# EasyEDA schematic SCH_d_00_e_02.json
TITLE: Sheet_1; REV: 1.0; Date: 2025-01-09; Sheet: 1/1; Drawn By: artem.v.ulyanov; Company: Your Company
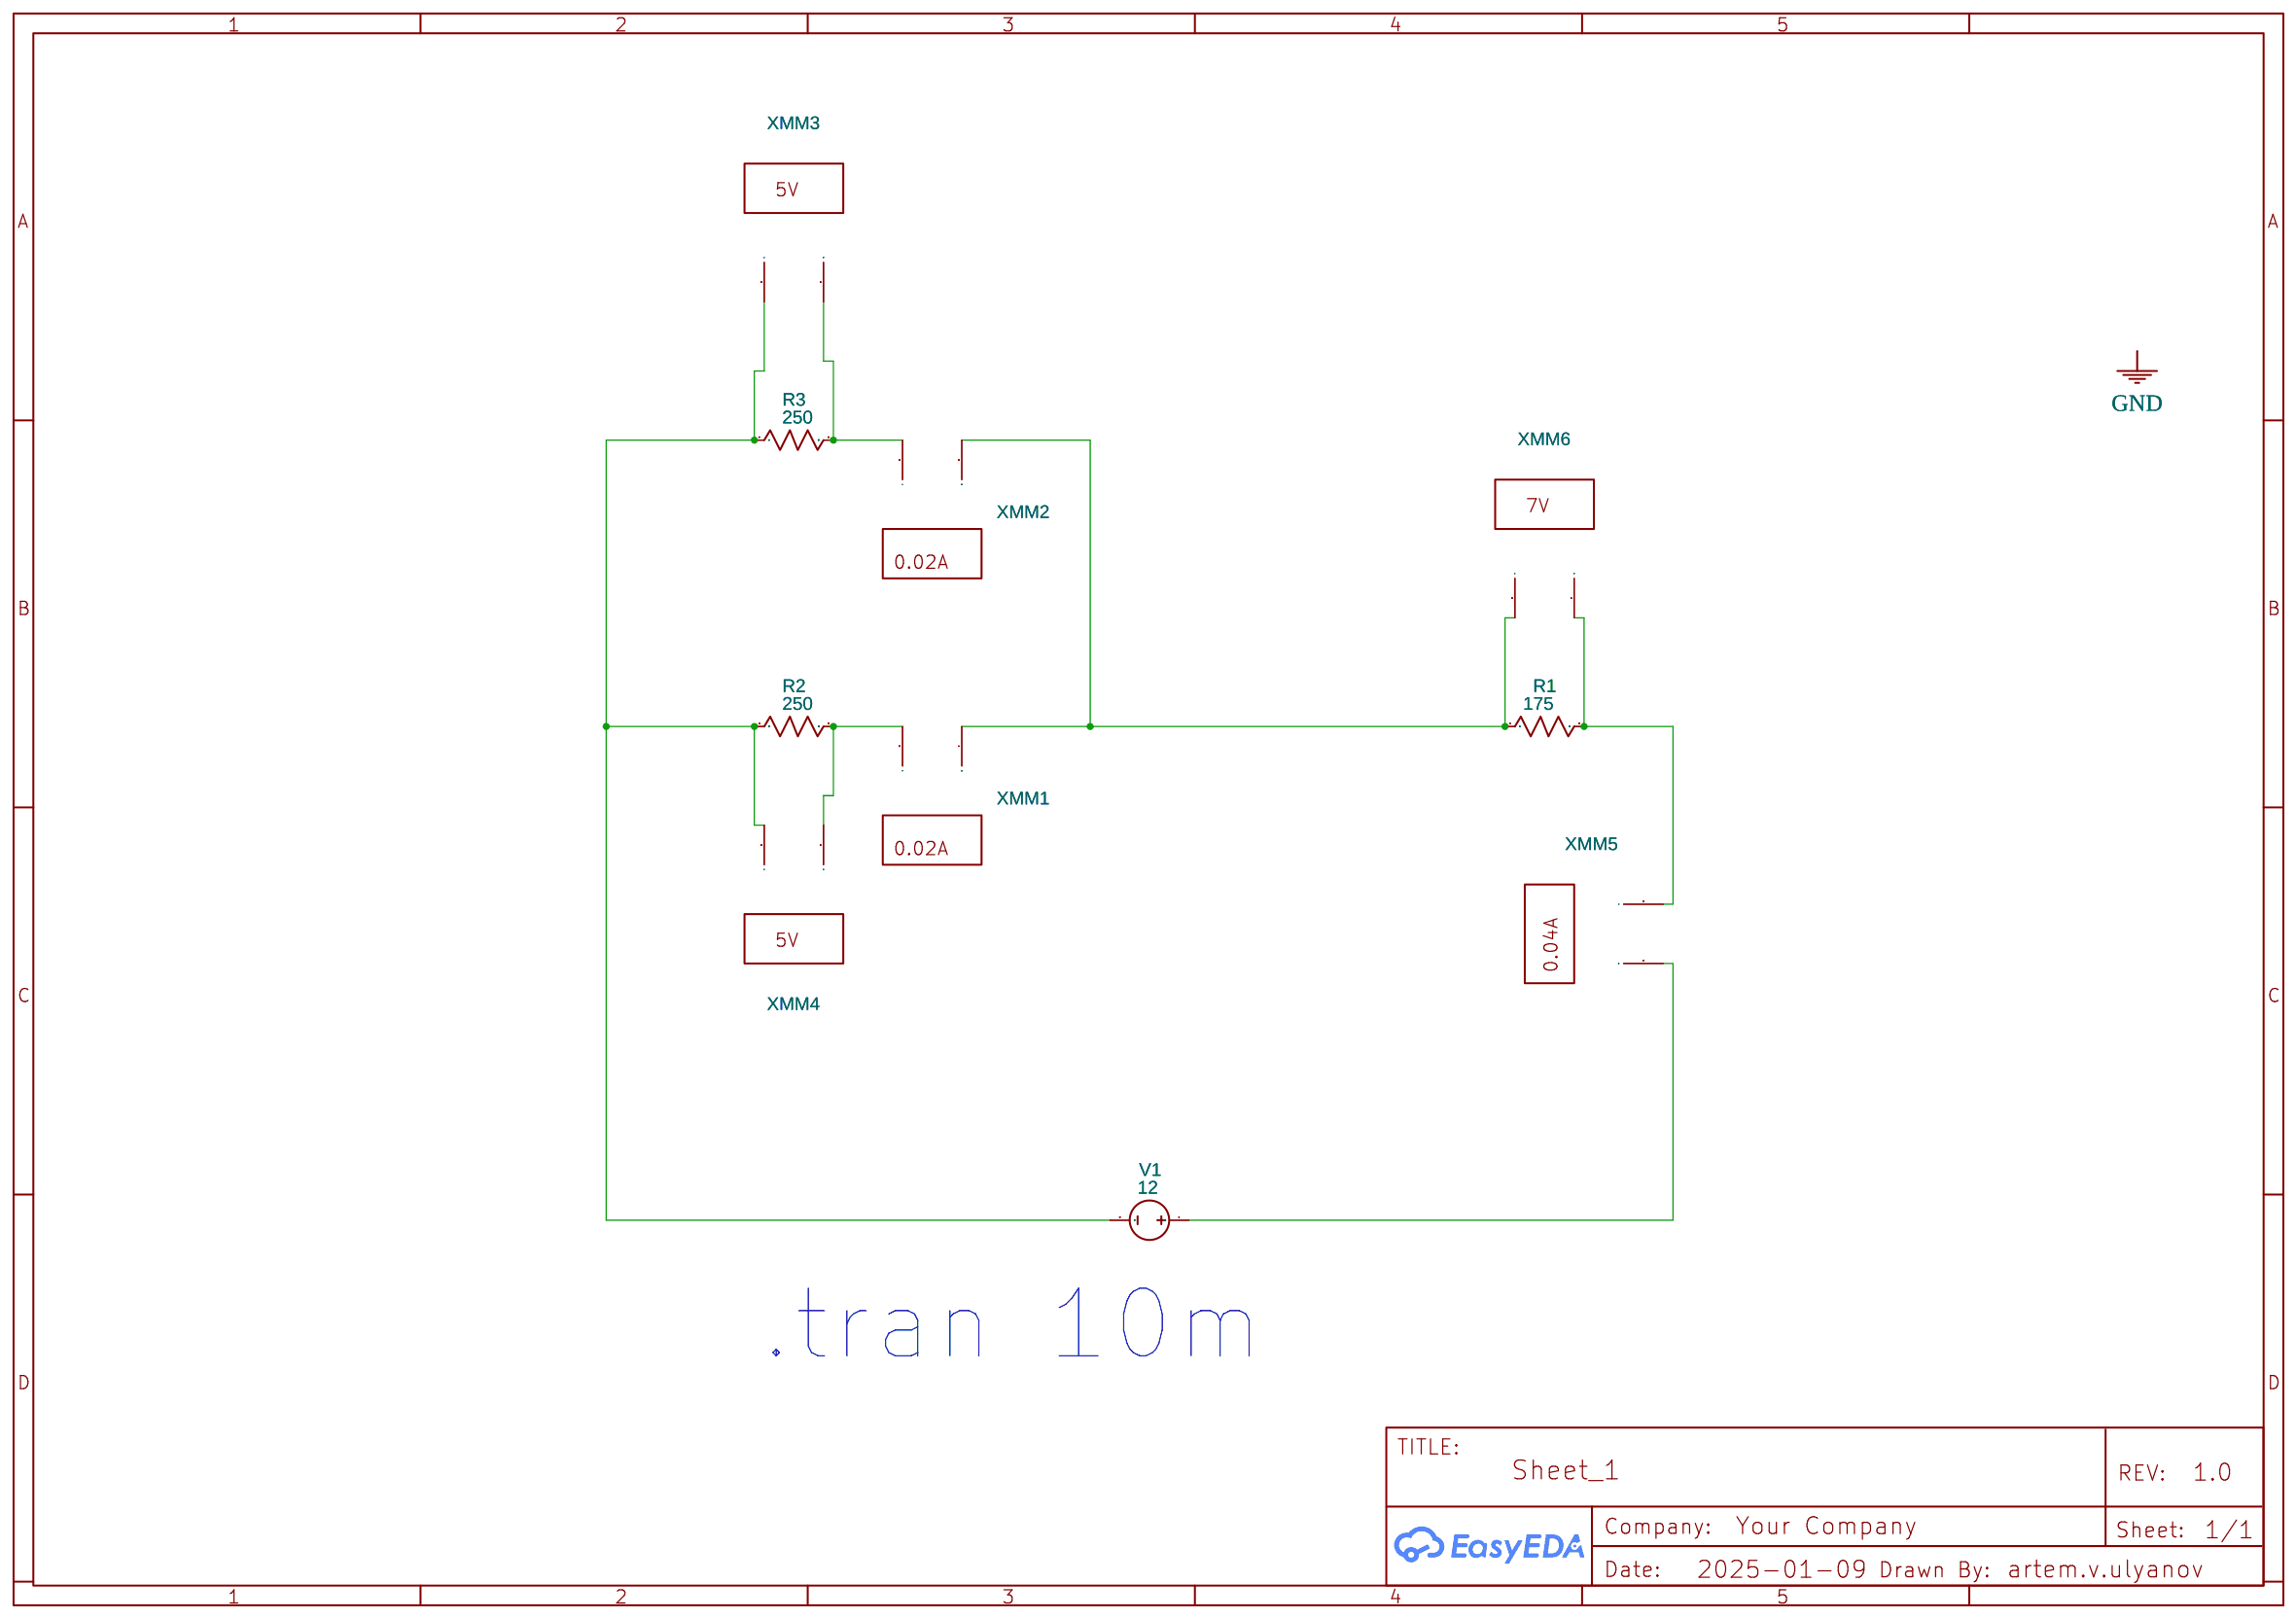
[diagram p0: schematic sheet]

## Parts
R1  175  [AXIAL-0.3]
R2  250  [AXIAL-0.3]
R3  250  [AXIAL-0.3]
V1  12  [HDR1X2]
XMM1  Multimeter
XMM2  Multimeter
XMM3  Multimeter
XMM4  Multimeter
XMM5  Multimeter
XMM6  Multimeter

## Library data of the parts
R1-R3 = Resistor_US: Resistance: 1k; Contributor: EasyEDA; Supplier: YUJING
V1 = VDC: Contributor: EasyEDA; sim: true
XMM1 XMM2 XMM5 = MULTIMETER: Supplier: LCSC; Multimeter Type: Amper; Power Type: AC; Voltmeter resistance: 10μ; Ammeter resistance: 1G; NameDisplay: 0; Contributor: EasyEDA; sim: true
XMM3 XMM4 XMM6 = MULTIMETER: Supplier: LCSC; Multimeter Type: Voltmeter; Power Type: AC; Voltmeter resistance: 10μ; Ammeter resistance: 1G; NameDisplay: 0; Contributor: EasyEDA; sim: true

## Nets
Net-(R1-1): R1.1 XMM1.1(+) XMM2.1(+) XMM6.2(I)
Net-(R1-2): R1.2 XMM5.2(I) XMM6.1(+)
Net-(R2-1): R2.1 R3.1 V1.2 XMM3.2(I) XMM4.2(I)
Net-(R2-2): R2.2 XMM1.2(I) XMM4.1(+)
Net-(R3-2): R3.2 XMM2.2(I) XMM3.1(+)
Net-(V1-1): V1.1 XMM5.1(+)

## Notes on the sheet
- .tran 10m
